# EAGLE design xyshield (EAGLE 6.5.0)
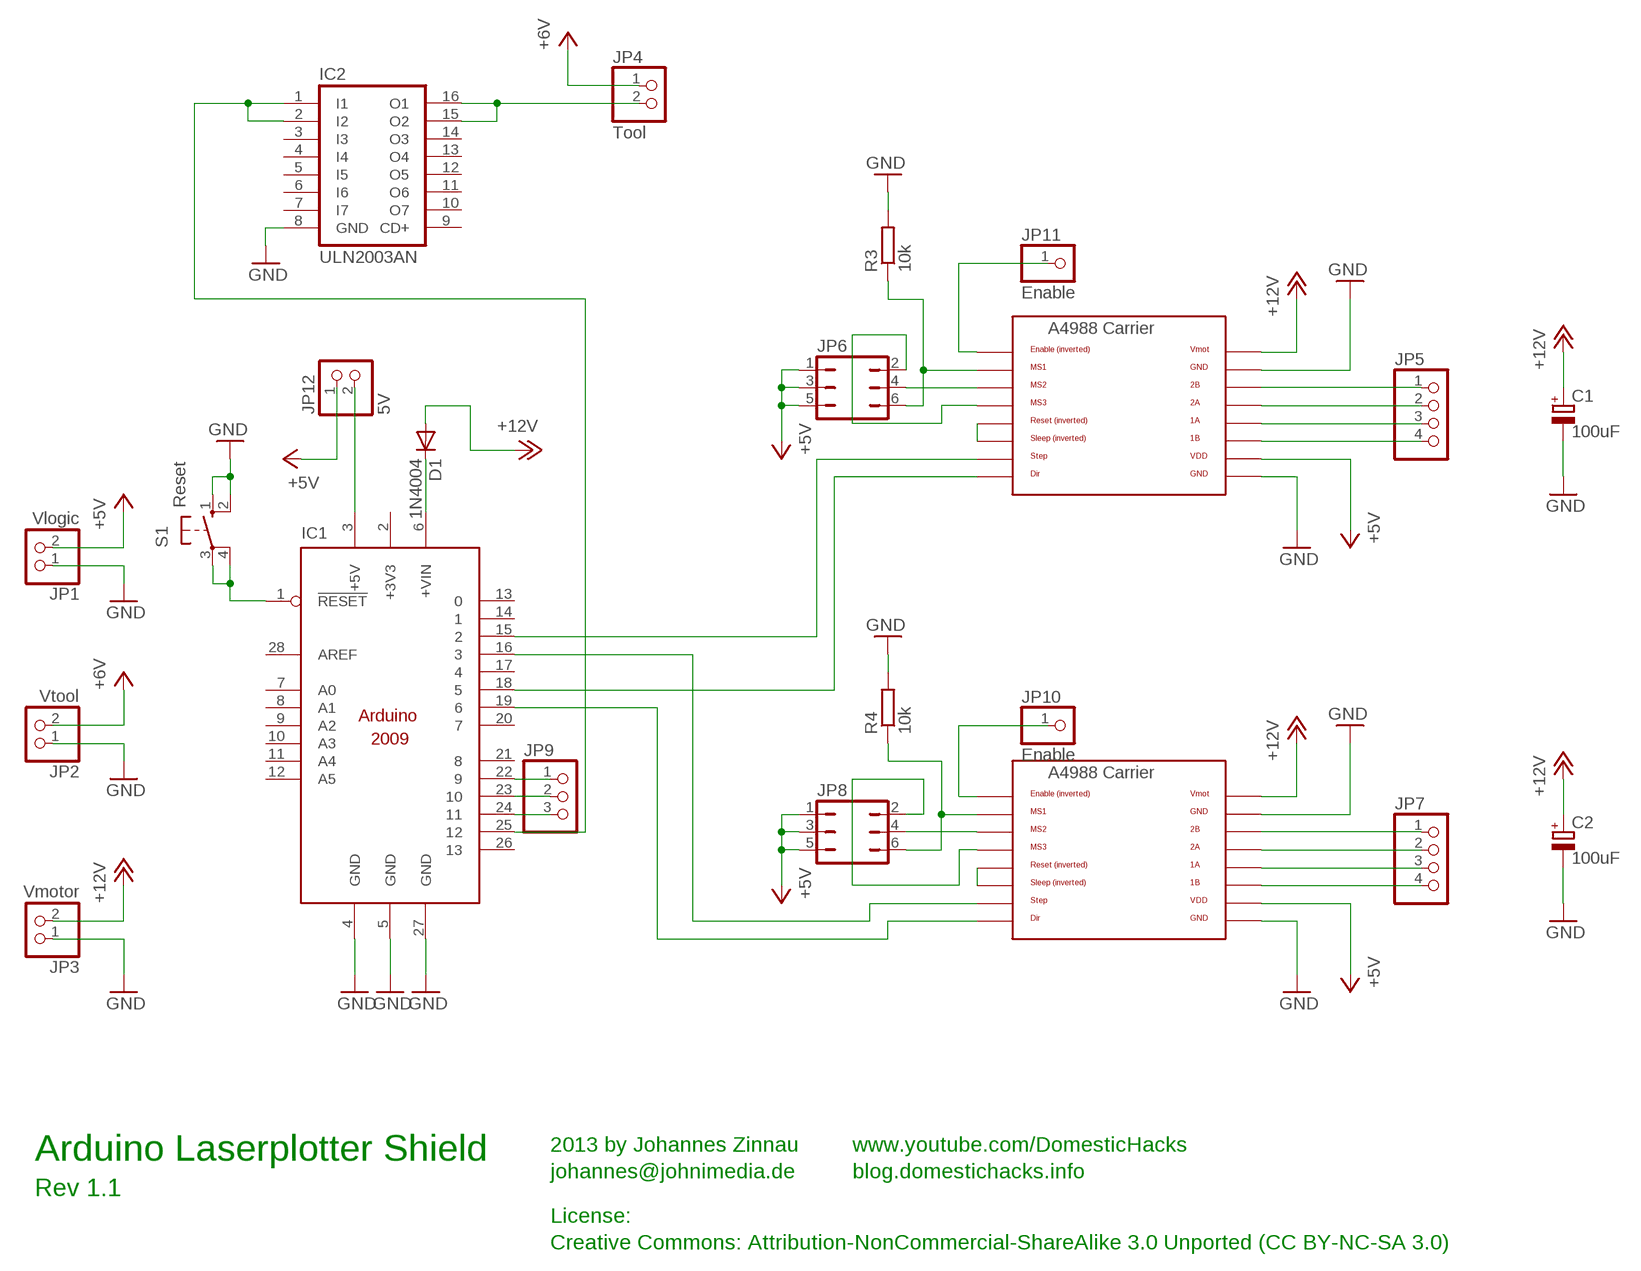
[diagram p0: schematic, sheet 1]

## Parts
C1  100uF  CPOL-EUE2.5-6  [E2,5-6]
C2  100uF  CPOL-EUE2.5-6  [E2,5-6]
D1  1N4004  [DO41-10]
IC1  Arduino  ARDUINO2009_10  [ARDUINO2009]
IC2  ULN2003AN  [DIL16]
JP1  Vlogic  PINHD-1X2  [1X02]
JP2  Vtool  PINHD-1X2  [1X02]
JP3  Vmotor  PINHD-1X2  [1X02]
JP4  Tool  PINHD-1X2  [1X02]
JP5  PINHD-1X4  [1X04]
JP6  JP3Q  [JP3Q]
JP7  PINHD-1X4  [1X04]
JP8  JP3Q  [JP3Q]
JP9  PINHD-1X3  [1X03]
JP10  Enable  PINHD-1X1  [1X01]
JP11  Enable  PINHD-1X1  [1X01]
JP12  5V  PINHD-1X2  [1X02]
R3  10k  R-EU_0204/2V  [0204V]
R4  10k  R-EU_0204/2V  [0204V]
S1  Reset  10-XX  [B3F-10XX]
U$1  POLOLU_A4983CARRIER  [A4988BREAKOUT]
U$2  POLOLU_A4983CARRIER  [A4988BREAKOUT]

## Nets
+5V: JP1.2 JP6.1 JP6.3 JP6.5 JP8.1 JP8.3 JP8.5 JP12.1 U$1.VDD U$2.VDD
+12V: C1.+ C2.+ D1.A JP3.2 U$1.VMOT U$2.VMOT
GND: C1.- C2.- IC1.4(GND) IC1.5(GND) IC1.27(GND) IC2.8(GND) JP1.1 JP2.1 JP3.1 R3.2 R4.2 S1.1(S) S1.2(S1) U$1.GND U$1.GND@0(GND) U$2.GND U$2.GND@0(GND)
N$1: IC1.25 IC2.1(I1) IC2.2(I2)
N$2: IC2.15(O2) IC2.16(O1) JP4.2
N$3: U$1.RST U$1.SLP(SLEEP)
N$4: JP5.3 U$1.1A
N$5: JP5.2 U$1.2A
N$6: JP5.1 U$1.2B
N$7: JP5.4 U$1.1B
N$8: JP6.6 R3.1 U$1.MS1
N$9: JP6.4 U$1.MS2
N$10: JP6.2 U$1.MS3
N$11: U$2.RST U$2.SLP(SLEEP)
N$12: JP7.4 U$2.1B
N$13: JP7.3 U$2.1A
N$14: JP7.2 U$2.2A
N$15: JP7.1 U$2.2B
N$16: JP8.6 R4.1 U$2.MS1
N$17: JP8.4 U$2.MS2
N$18: JP8.2 U$2.MS3
N$19: IC1.15 U$1.STEP
N$20: IC1.18 U$1.DIR
N$21: IC1.16 U$2.STEP
N$22: IC1.19 U$2.DIR
N$23: IC1.22 JP9.1
N$24: IC1.23 JP9.2
N$25: IC1.24 JP9.3
N$26: JP11.1 U$1.EN
N$27: JP10.1 U$2.EN
N$28: IC1.1(!RESET) S1.3(P) S1.4(P1)
N$29: D1.C IC1.6(+VIN)
N$30: IC1.3(+5V) JP12.2
VCC: JP2.2 JP4.1 ; supply symbol labelled +6V
Unconnected: IC1.7(A0) IC1.8(A1) IC1.9(A2) IC1.10(A3) IC1.11(A4) IC1.12(A5) IC1.13 IC1.14 IC1.17 IC1.20 IC1.21 IC1.26 IC1.28(AREF) IC2.3(I3) IC2.4(I4) IC2.5(I5) IC2.6(I6) IC2.7(I7) IC2.9(CD+) IC2.10(O7) IC2.11(O6) IC2.12(O5) IC2.13(O4) IC2.14(O3)

## Notes on the sheet
- 2013 by Johannes Zinnau | www.youtube.com/DomesticHacks
- Arduino Laserplotter Shield
- johannes@johnimedia.de | blog.domestichacks.info
- Rev 1.1
- License:
- Creative Commons: Attribution-NonCommercial-ShareAlike 3.0 Unported (CC BY-NC-SA 3.0)

## Power pins joined to a net without a drawn wire
+3V3: IC1.2(+3V3)

## Library data of the parts
C1 C2 = rcl:CPOL-EU: POLARIZED CAPACITOR, European symbol
D1 = diode:1N4004: DIODE general purpose rectifier, 1 A
IC1 = arduino:ARDUINO2009_1: The Arduino Duemilanove ("2009") is a microcontroller board based on the ATmega168 or ATmega328. - 14 digital input/output pins (of which 6 can be used as PWM outputs) - 6 analog inputs, a 16 MHz crystal oscillator - USB connection - power jack - ISP header - reset button It contains everything needed to support the microcontroller; simply connect it to a computer with a USB cable or power it with a AC-to-DC adapter or battery to get started http://arduino.cc/en/Main/ArduinoBoardDuemilanove
IC2 = uln-udn:ULN2003A: DRIVER ARRAY
JP1-JP4 JP12 = pinhead:PINHD-1X2: PIN HEADER
JP5 JP7 = pinhead:PINHD-1X4: PIN HEADER
JP6 JP8 = jumper:JP3Q: JUMPER
JP9 = pinhead:PINHD-1X3: PIN HEADER
JP10 JP11 = pinhead:PINHD-1X1: PIN HEADER
R3 R4 = resistor:R-EU_: RESISTOR, European symbol
S1 = switch-omron:10-XX: OMRON SWITCH; MPN: B3F-1000; OC_FARNELL: 176432; OC_NEWARK: 36M3542
U$1 U$2 = RepRapjr:POLOLU_A4983CARRIER

## Board
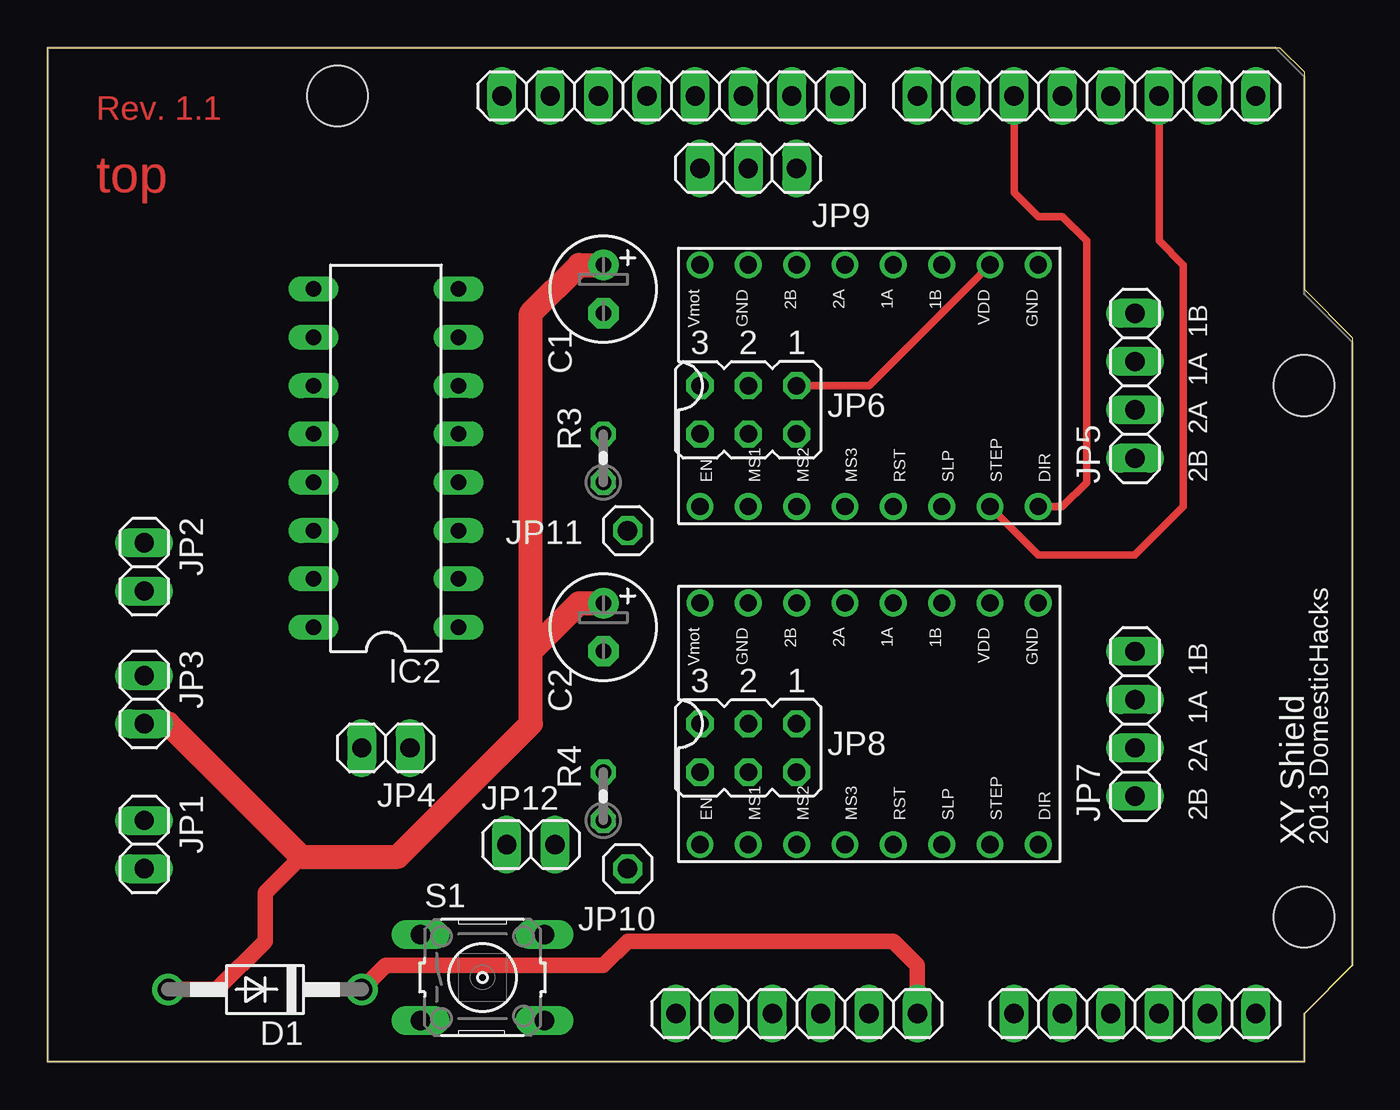
[diagram p1: board, top side]
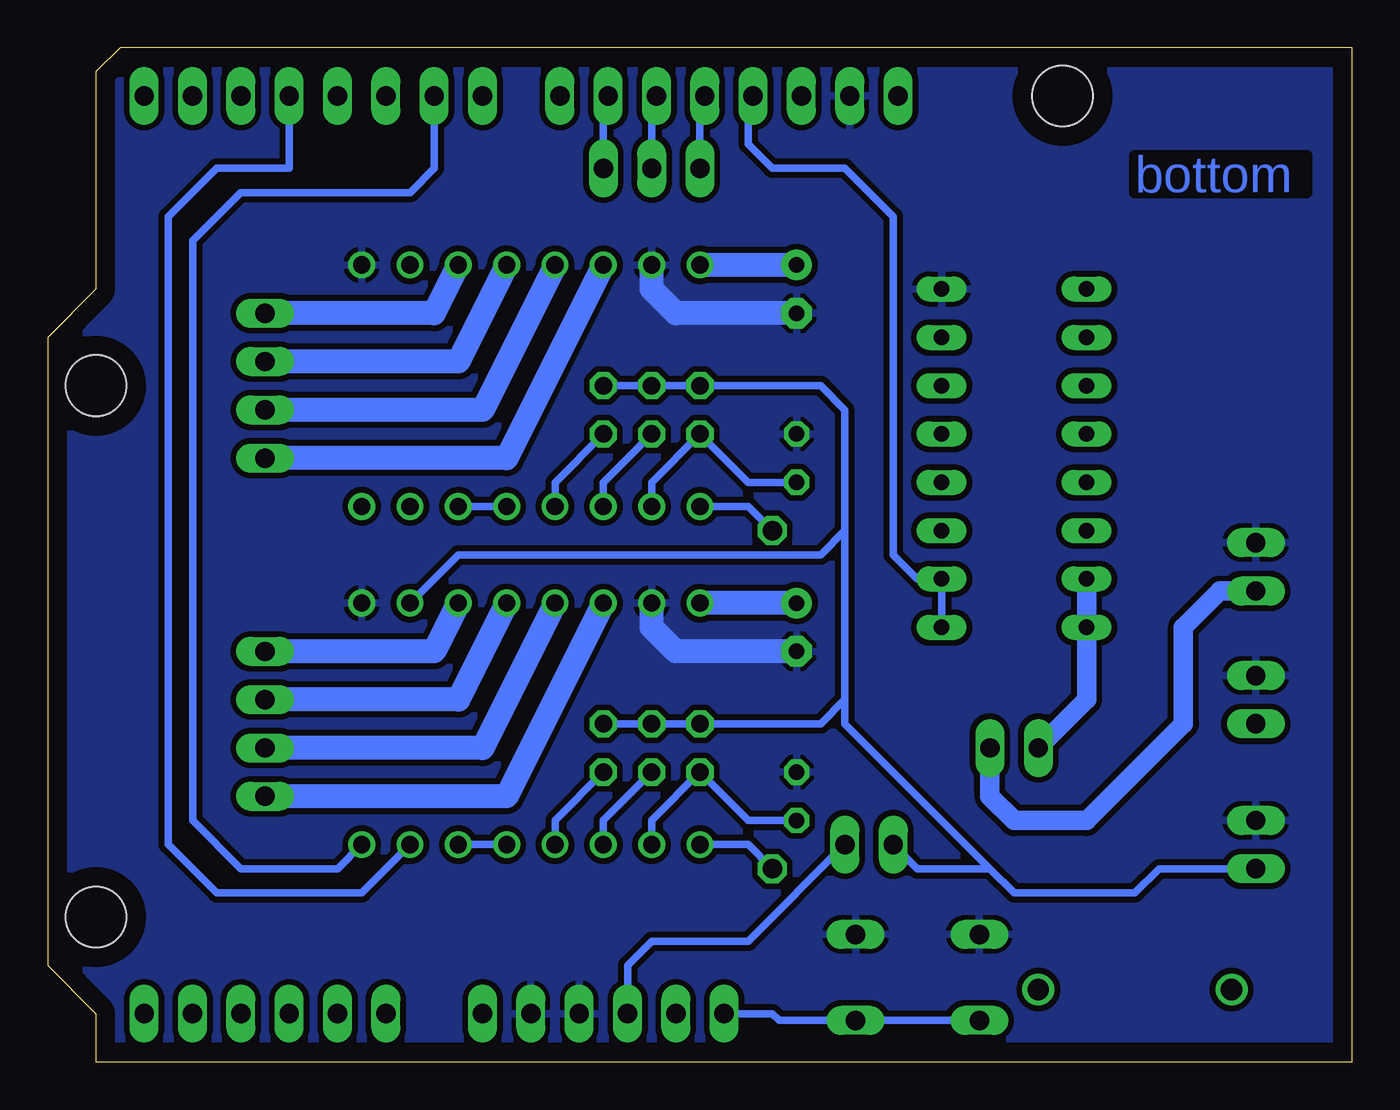
[diagram p2: board, bottom side, seen from below]

Size 68.58 x 53.34 mm. Coordinates in mm from the lower left corner, seen from the top.
Outline: 0,0 0,53.34 64.77,53.34 66.04,52.07 66.04,40.64 68.58,38.1 68.58,5.08 66.04,2.54 66.04,0 0,0
Copper layers (1*16): Top 0.035mm / dielectric 1.5mm / Bottom 0.035mm
Design rules "default": minimum track width 10mil, minimum drill 24mil, track to track 8mil, track to pad 8mil, pad to pad 8mil, via to via 8mil, smd to smd 8mil, copper to edge 40mil, drill to drill 8mil, minimum pad ring 10mil, minimum via ring 8mil, stop-mask expansion 4mil, vias tented up to drill 0mil, thermal gap 10mil

### Footprints (pad centres in the part's own frame; a part is rotated, then mirrored left to right if it is on the bottom)
E2,5-6 = drill 0.813 pad 1.6: + -1.27,0 | drill 0.813 pad 1.6 octagon: - 1.27,0
DO41-10 = drill 1.118: A 5.08,0; C -5.08,0
ARDUINO2009 = drill 1.016 long: 1 33.02,2.54; 2 35.56,2.54; 3 38.1,2.54; 4 40.64,2.54; 5 43.18,2.54; 6 45.72,2.54; 7 50.8,2.54; 8 53.34,2.54; 9 55.88,2.54; 10 58.42,2.54; 11 60.96,2.54; 12 63.5,2.54; 13 63.5,50.8; 14 60.96,50.8; 15 58.42,50.8; 16 55.88,50.8; 17 53.34,50.8; 18 50.8,50.8; 19 48.26,50.8; 20 45.72,50.8; 21 41.656,50.8; 22 39.116,50.8; 23 36.576,50.8; 24 34.036,50.8; 25 31.496,50.8; 26 28.956,50.8; 27 26.416,50.8; 28 23.876,50.8 | hole 3.2: 15.24,50.8; 66.04,35.56; 66.04,7.62
DIL16 = drill 0.813 long: 1 -8.89,-3.81; 2 -6.35,-3.81; 3 -3.81,-3.81; 4 -1.27,-3.81; 5 1.27,-3.81; 6 3.81,-3.81; 7 6.35,-3.81; 8 8.89,-3.81; 9 8.89,3.81; 10 6.35,3.81; 11 3.81,3.81; 12 1.27,3.81; 13 -1.27,3.81; 14 -3.81,3.81; 15 -6.35,3.81; 16 -8.89,3.81
1X02 = drill 1.016 long: 1 -1.27,0; 2 1.27,0
1X04 = drill 1.016 long: 1 -3.81,0; 2 -1.27,0; 3 1.27,0; 4 3.81,0
JP3Q = drill 0.914 octagon: 1 -2.54,-1.27; 2 -2.54,1.27; 3 0,-1.27; 4 0,1.27; 5 2.54,-1.27; 6 2.54,1.27
1X03 = drill 1.016 long: 1 -2.54,0; 2 0,0; 3 2.54,0
1X01 = drill 1.016 octagon: 1 0,0
0204V = drill 0.813 octagon: 1 -1.27,0; 2 1.27,0
B3F-10XX = drill 1.016 long: 1 -3.251,2.261; 2 3.251,2.261; 3 -3.251,-2.261; 4 3.251,-2.261
A4988BREAKOUT = drill 0.9: 1A 8.89,1.27; 1B 11.43,1.27; 2A 6.35,1.27; 2B 3.81,1.27; DIR 16.51,-11.43; EN -1.27,-11.43; GND 16.51,1.27; GND@0 1.27,1.27; MS1 1.27,-11.43; MS2 3.81,-11.43; MS3 6.35,-11.43; RST 8.89,-11.43; SLP 11.43,-11.43; STEP 13.97,-11.43; VDD 13.97,1.27; VMOT -1.27,1.27

### Placement (x,y rotation side)
C1  29.21,40.64 270 top
C2  29.21,22.86 270 top
D1  11.43,3.81 180 top
IC1  0,0 0 top
IC2  17.78,31.75 90 top
JP1  5.08,11.43 270 top
JP2  5.08,26.04 270 top
JP3  5.08,19.05 270 top
JP4  17.78,16.51 180 top
JP5  57.15,35.56 90 top
JP6  36.83,34.29 180 top
JP7  57.15,17.78 90 top
JP8  36.83,16.51 180 top
JP9  36.83,46.99 180 top
JP10  30.48,10.16 0 top
JP11  30.48,27.94 0 top
JP12  25.4,11.43 0 top
R3  29.21,31.75 90 top
R4  29.21,13.97 90 top
S1  22.86,4.45 0 top
U$1  35.56,40.64 0 top
U$2  35.56,22.86 0 top

### Tracks (layer width: path | path; a pad name or v marks a point on that pad's centre or on a via)
+5V
  Top 0.406: JP6.1 43.18,35.56 U$1.VDD
  Bottom 0.406: JP6.1 JP6.3 JP6.5 27.94,35.56 26.67,34.29 26.67,27.94 | JP1.2 10.16,10.16 11.43,8.89 17.78,8.89 19.05,10.16 | 26.67,19.05 27.94,17.78 JP8.5 JP8.3 JP8.1 | 26.67,19.05 26.67,27.94 | U$2.VDD 46.99,26.67 27.94,26.67 26.67,27.94 | 26.67,19.05 26.67,17.78 19.05,10.16 | JP12.1 22.86,10.16 19.05,10.16
+12V
  Top 0.813: D1.A 8.89,3.81 11.43,6.35 11.43,8.89 13.34,10.79
  Top 1.27: C1.+ 27.94,41.91 25.4,39.37 25.4,21.59 | 25.4,21.59 25.4,17.78 18.41,10.79 13.34,10.79 6.35,17.78 JP3.2 | 25.4,21.59 27.94,24.13 C2.+
  Bottom 1.27: C1.+ U$1.VMOT | C2.+ U$2.VMOT
GND
  Bottom 1.27: C1.- 35.56,39.37 36.83,40.64 U$1.GND@0 | C2.- 35.56,21.59 36.83,22.86 U$2.GND@0
  pour Bottom (isolate 0.305): 0,53.34 64.77,53.34 66.04,52.07 66.04,40.64 68.58,38.1 68.58,5.08 66.04,2.54 66.04,0 0,0
N$1
  Bottom 0.406: IC2.1 IC2.2 22.86,25.4 24.13,26.67 24.13,44.45 26.67,46.99 30.48,46.99 31.75,48.26 31.75,50.55 IC1.25
N$2
  Bottom 1.016: IC2.15 IC2.16 13.97,19.05 JP4.2
N$3
  Bottom 0.406: U$1.RST U$1.SLP
N$4
  Bottom 1.27: JP5.3 46.99,36.83 U$1.1A
N$5
  Bottom 1.27: JP5.2 45.72,34.29 U$1.2A
N$6
  Bottom 1.27: U$1.2B 44.45,31.75 JP5.1
N$7
  Bottom 1.27: JP5.4 48.26,39.37 U$1.1B
N$8
  Bottom 0.406: U$1.MS1 36.83,30.48 JP6.6 31.75,30.48 R3.1
N$9
  Bottom 0.406: JP6.4 39.37,30.48 U$1.MS2
N$10
  Bottom 0.406: JP6.2 41.91,30.48 U$1.MS3
N$11
  Bottom 0.406: U$2.RST U$2.SLP
N$12
  Bottom 1.27: U$2.1B 48.26,21.59 JP7.4
N$13
  Bottom 1.27: JP7.3 46.99,19.05 U$2.1A
N$14
  Bottom 1.27: U$2.2A 45.72,16.51 JP7.2
N$15
  Bottom 1.27: U$2.2B 44.45,13.97 JP7.1
N$16
  Bottom 0.406: U$2.MS1 36.83,12.7 JP8.6 31.75,12.7 R4.1
N$17
  Bottom 0.406: U$2.MS2 39.37,12.7 JP8.4
N$18
  Bottom 0.406: U$2.MS3 41.91,12.7 JP8.2
N$19
  Top 0.406: U$1.STEP 52.07,26.67 57.15,26.67 59.69,29.21 59.69,41.91 58.42,43.18 IC1.15
N$20
  Top 0.406: U$1.DIR 53.34,29.21 54.61,30.48 54.61,43.18 53.34,44.45 52.07,44.45 50.8,45.72 IC1.18
N$21
  Bottom 0.406: U$2.STEP 52.07,8.89 59.69,8.89 62.23,11.43 62.23,44.45 59.69,46.99 55.88,46.99 IC1.16
N$22
  Bottom 0.406: U$2.DIR 53.34,10.16 58.42,10.16 60.96,12.7 60.96,43.18 58.42,45.72 49.53,45.72 48.26,46.99 IC1.19
N$23
  Bottom 0.406: IC1.22 39.37,50.55 JP9.1
N$24
  Bottom 0.406: IC1.23 36.83,50.55 JP9.2
N$25
  Bottom 0.406: IC1.24 34.29,50.55 JP9.3
N$26
  Bottom 0.406: JP11.1 31.75,29.21 U$1.EN
N$27
  Bottom 0.406: JP10.1 31.75,11.43 U$2.EN
N$28
  Bottom 0.406: S1.3 S1.4 30.12,2.18 30.48,2.54 IC1.1
N$29
  Top 0.813: IC1.6 45.72,5.08 44.45,6.35 30.48,6.35 29.21,5.08 17.78,5.08 D1.C
N$30
  Bottom 0.406: JP12.2 31.75,6.35 36.83,6.35 38.1,5.08 IC1.3
VCC
  Bottom 1.016: JP2.2 6.99,24.77 8.89,22.86 8.89,17.78 13.97,12.7 17.78,12.7 19.05,13.97 JP4.1

### Text on the board
Top: Rev. 1.1 | top
Bottom: bottom
tNames: 1B | 1A | 2A | 2B | 1B | 1A | 2A | 2B | XY Shield | 2013 DomesticHacks